# Altium schematic sheet PIC.SchDoc
size A
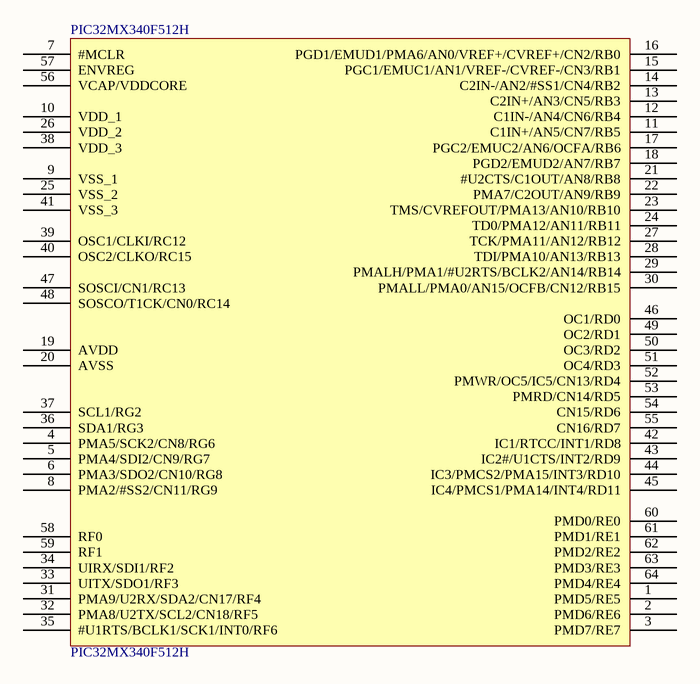
[diagram p0: PIC.SchDoc]

## Parts
PIC32MX340F512H  PIC32MX340F512H

## Nets

Not connected (* = marked no-connect by the designer): PIC32MX340F512H 1(PMD5/RE5) 2(PMD6/RE6) 3(PMD7/RE7) 4(PMA5/SCK2/CN8/RG6) 5(PMA4/SDI2/CN9/RG7) 6(PMA3/SDO2/CN10/RG8) 7(#MCLR) 8(PMA2/#SS2/CN11/RG9) 9(VSS_1) 10(VDD_1) 11(C1IN+/AN5/CN7/RB5) 12(C1IN-/AN4/CN6/RB4) 13(C2IN+/AN3/CN5/RB3) 14(C2IN-/AN2/#SS1/CN4/RB2) 15(PGC1/EMUC1/AN1/VREF-/CVREF-/CN3/RB1) 16(PGD1/EMUD1/PMA6/AN0/VREF+/CVREF+/CN2/RB0) 17(PGC2/EMUC2/AN6/OCFA/RB6) 18(PGD2/EMUD2/AN7/RB7) 19(AVDD) 20(AVSS) 21(#U2CTS/C1OUT/AN8/RB8) 22(PMA7/C2OUT/AN9/RB9) 23(TMS/CVREFOUT/PMA13/AN10/RB10) 24(TD0/PMA12/AN11/RB11) 25(VSS_2) 26(VDD_2) 27(TCK/PMA11/AN12/RB12) 28(TDI/PMA10/AN13/RB13) 29(PMALH/PMA1/#U2RTS/BCLK2/AN14/RB14) 30(PMALL/PMA0/AN15/OCFB/CN12/RB15) 31(PMA9/U2RX/SDA2/CN17/RF4) 32(PMA8/U2TX/SCL2/CN18/RF5) 33(UITX/SDO1/RF3) 34(UIRX/SDI1/RF2) 35(#U1RTS/BCLK1/SCK1/INT0/RF6) 36(SDA1/RG3) 37(SCL1/RG2) 38(VDD_3) 39(OSC1/CLKI/RC12) 40(OSC2/CLKO/RC15) 41(VSS_3) 42(IC1/RTCC/INT1/RD8) 43(IC2#/U1CTS/INT2/RD9) 44(IC3/PMCS2/PMA15/INT3/RD10) 45(IC4/PMCS1/PMA14/INT4/RD11) 46(OC1/RD0) 47(SOSCI/CN1/RC13) 48(SOSCO/T1CK/CN0/RC14) 49(OC2/RD1) 50(OC3/RD2) 51(OC4/RD3) 52(PMWR/OC5/IC5/CN13/RD4) 53(PMRD/CN14/RD5) 54(CN15/RD6) 55(CN16/RD7) 56(VCAP/VDDCORE) 57(ENVREG) 58(RF0) 59(RF1) 60(PMD0/RE0) 61(PMD1/RE1) 62(PMD2/RE2) 63(PMD3/RE3) 64(PMD4/RE4)